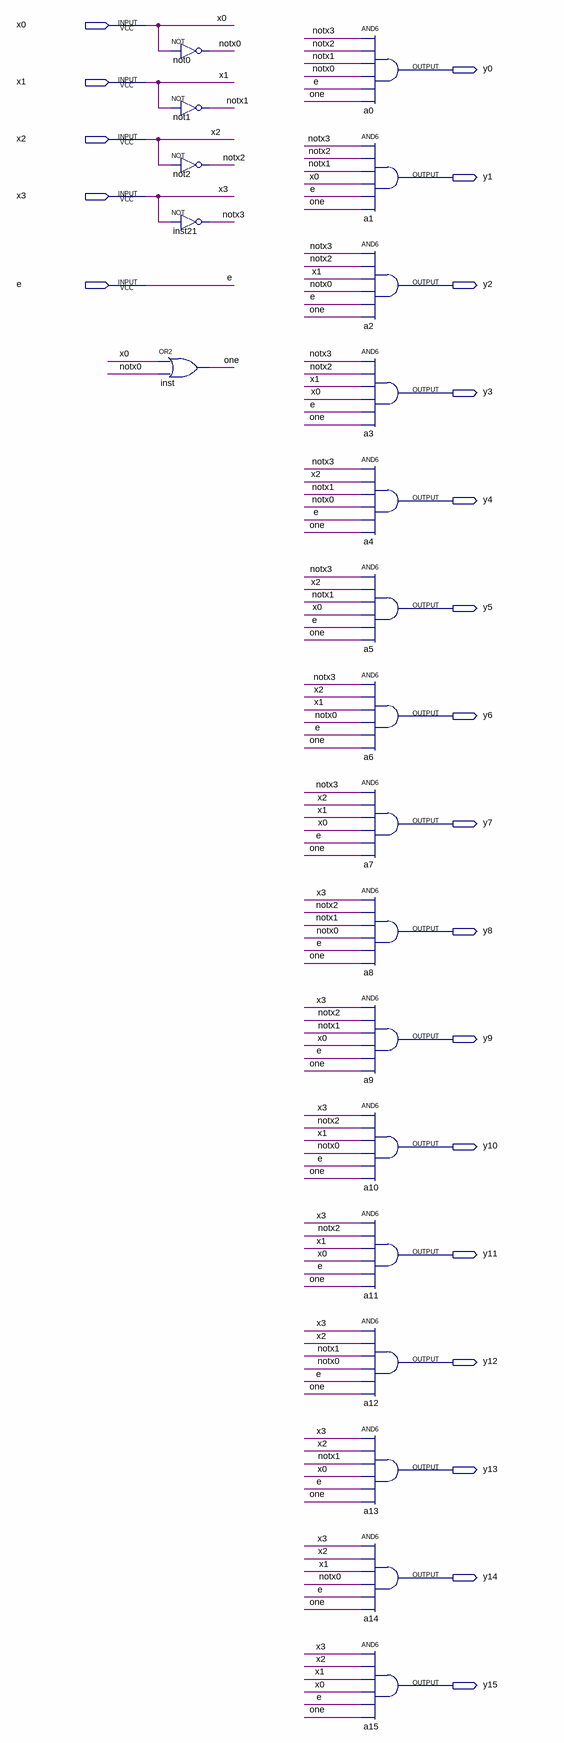
[diagram p0: schematic sheet]
// Quartus schematic lab-1.bdf as structural Verilog: 21 symbols, 21 pins
module \lab-1  (
  input  x0,
  input  x1,
  input  x2,
  input  x3,
  input  e,
  output y0,
  output y1,
  output y2,
  output y3,
  output y4,
  output y5,
  output y6,
  output y7,
  output y8,
  output y9,
  output y10,
  output y11,
  output y12,
  output y13,
  output y14,
  output y15
);

  wire notx0, notx1, notx2, notx3, one;

  or inst (one, x0, notx0);
  not not0 (notx0, x0);
  not not1 (notx1, x1);
  not not2 (notx2, x2);
  not inst21 (notx3, x3);
  and a0 (y0, notx3, notx2, notx1, notx0, e, one);
  and a1 (y1, notx3, notx2, notx1, x0, e, one);
  and a2 (y2, notx3, notx2, x1, notx0, e, one);
  and a3 (y3, notx3, notx2, x1, x0, e, one);
  and a4 (y4, notx3, x2, notx1, notx0, e, one);
  and a5 (y5, notx3, x2, notx1, x0, e, one);
  and a6 (y6, notx3, x2, x1, notx0, e, one);
  and a7 (y7, notx3, x2, x1, x0, e, one);
  and a8 (y8, x3, notx2, notx1, notx0, e, one);
  and a9 (y9, x3, notx2, notx1, x0, e, one);
  and a10 (y10, x3, notx2, x1, notx0, e, one);
  and a11 (y11, x3, notx2, x1, x0, e, one);
  and a12 (y12, x3, x2, notx1, notx0, e, one);
  and a13 (y13, x3, x2, notx1, x0, e, one);
  and a14 (y14, x3, x2, x1, notx0, e, one);
  and a15 (y15, x3, x2, x1, x0, e, one);
endmodule
